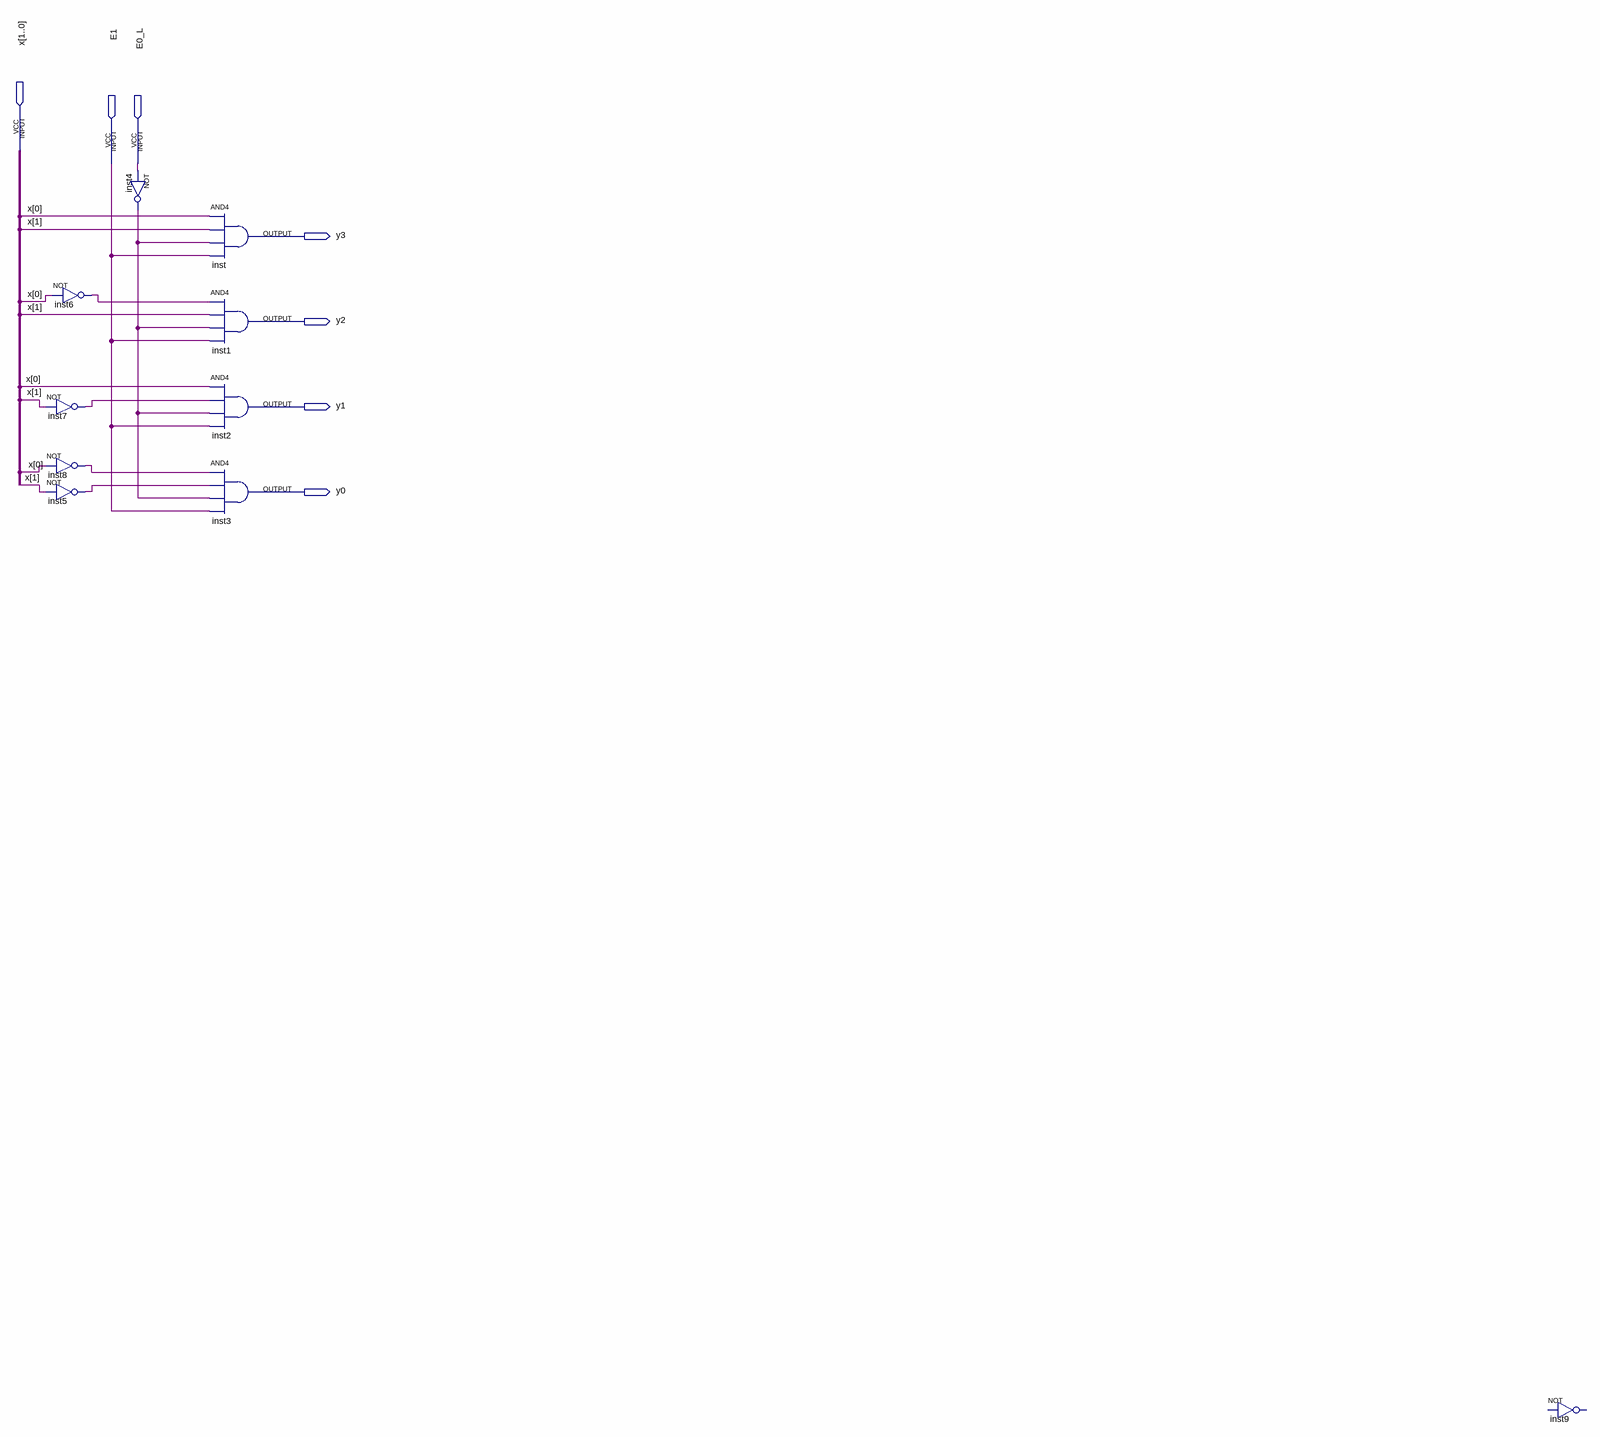
[diagram p0: schematic sheet]
// Quartus schematic Dec2_4.bdf as structural Verilog: 10 symbols, 7 pins
module Dec2_4 (
  input  [1:0] x,
  input  E1,
  input  E0_L,
  output y3,
  output y2,
  output y1,
  output y0
);

  wire inst4_out, inst5_out, inst6_out, inst7_out, inst8_out;

  not inst6 (inst6_out, x[0]);
  not inst7 (inst7_out, x[1]);
  not inst8 (inst8_out, x[0]);
  not inst5 (inst5_out, x[1]);
  not inst4 (inst4_out, E0_L);
  and inst (y3, x[0], x[1], inst4_out, E1);
  and inst1 (y2, inst6_out, x[1], inst4_out, E1);
  and inst2 (y1, x[0], inst7_out, inst4_out, E1);
  and inst3 (y0, inst8_out, inst5_out, inst4_out, E1);
  // NOT inst9 is placed but not wired
endmodule
